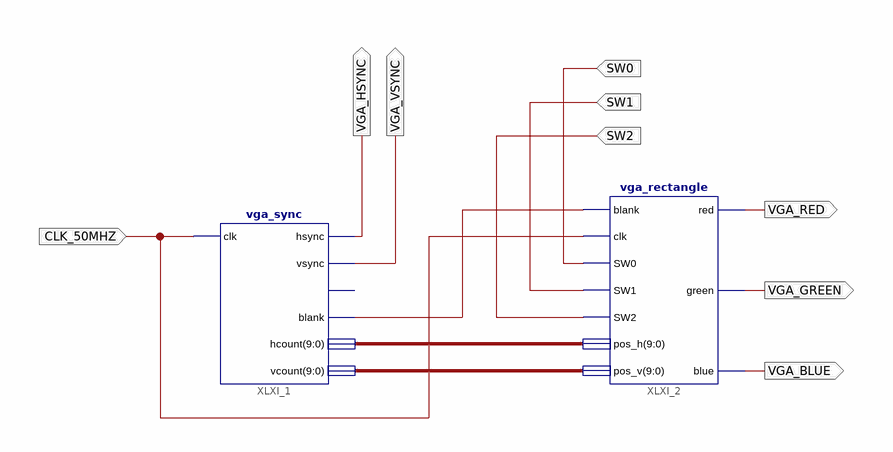
[diagram p0: schematic sheet 1]
// Xilinx ISE schematic top.sch (spartan3e) as structural Verilog: 2 symbols, 9 ports
module top (
  input  CLK_50MHZ,
  input  SW2,
  input  SW1,
  input  SW0,
  output VGA_HSYNC,
  output VGA_VSYNC,
  output VGA_RED,
  output VGA_GREEN,
  output VGA_BLUE
);

  wire XLXN_4;
  wire [9:0] XLXN_2, XLXN_3;

  vga_sync XLXI_1 (
    .clk(CLK_50MHZ), .hsync(VGA_HSYNC), .vsync(VGA_VSYNC), .blank(XLXN_4), .hcount(XLXN_3), .vcount(XLXN_2));  // open: pix_clk
  vga_rectangle XLXI_2 (
    .blank(XLXN_4), .clk(CLK_50MHZ), .SW0(SW0), .SW1(SW1), .SW2(SW2), .pos_h(XLXN_3), .pos_v(XLXN_2),
    .red(VGA_RED), .green(VGA_GREEN), .blue(VGA_BLUE));
endmodule
